# Altium schematic sheet LEDs, and Motors.SchDoc
size A4; SheetNumber: 2; SheetTotal: 3
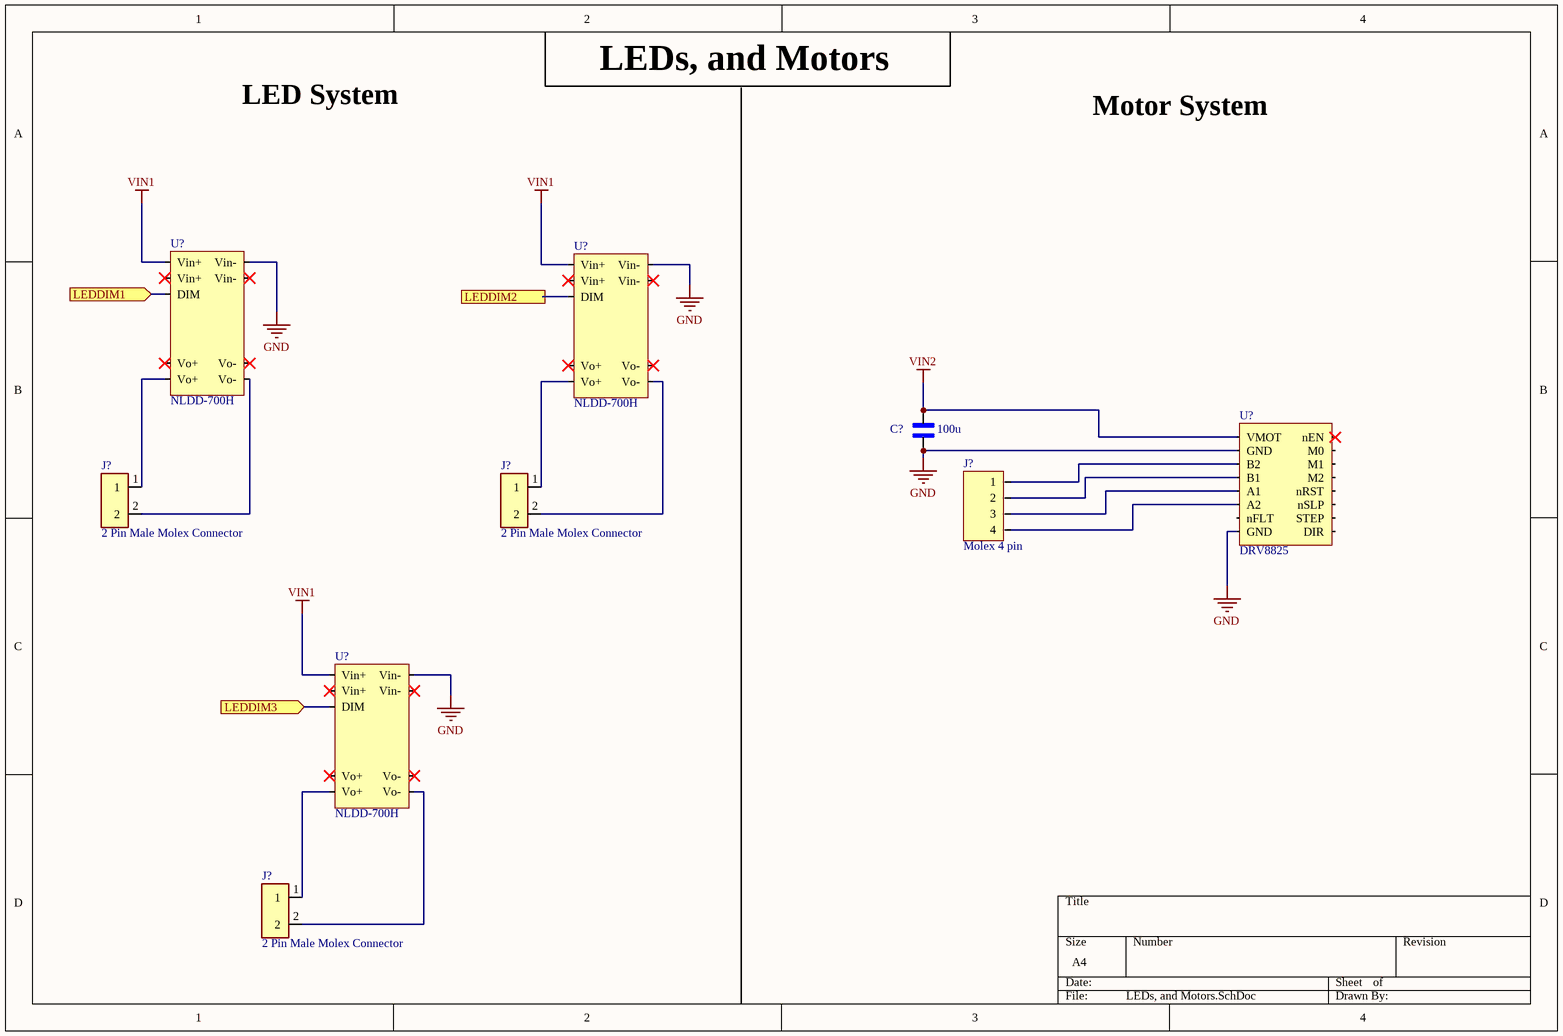
[diagram p0: LEDs, and Motors.SchDoc]

## Parts
(Parts that share a designator on the sheet are numbered #1, #2 ... from top to bottom, then left to right.)
C?  100u  [CAP 0805]
J?#1  Molex 4 pin  [Connector Molex MicroFit+ 4 Pos R/A]
J?#2  2 Pin Male Molex Connector  [MOLEX_0436500200]
J?#3  2 Pin Male Molex Connector  [MOLEX_0436500200]
J?#4  2 Pin Male Molex Connector  [MOLEX_0436500200]
U?#1  NLDD-700H  [NLDD-700H]
U?#2  NLDD-700H  [NLDD-700H]
U?#3  DRV8825  [DRV8825]
U?#4  NLDD-700H  [NLDD-700H]

## Ports
LEDDIM1 (in), LEDDIM2 (in), LEDDIM3 (in)

## Nets
GND: C?.1 U?#1.9(Vin-) U?#2.9(Vin-) U?#3.2(GND) U?#3.8(GND) U?#4.9(Vin-)
VIN1: U?#1.1(Vin+) U?#2.1(Vin+) U?#4.1(Vin+)
VIN2: C?.2 U?#3.1(VMOT)
LEDDIM1: U?#1.3(DIM) ; port LEDDIM1
LEDDIM2: U?#2.3(DIM) ; port LEDDIM2
LEDDIM3: U?#4.3(DIM) ; port LEDDIM3
NetJ?#1_1: J?#1.1 U?#3.3(B2)
NetJ?#1_2: J?#1.2 U?#3.4(B1)
NetJ?#1_3: J?#1.3 U?#3.5(A1)
NetJ?#1_4: J?#1.4 U?#3.6(A2)
NetJ?#2_1: J?#2.1 U?#1.5(Vo+)
NetJ?#2_2: J?#2.2 U?#1.6(Vo-)
NetJ?#3_1: J?#3.1 U?#2.5(Vo+)
NetJ?#3_2: J?#3.2 U?#2.6(Vo-)
NetJ?#4_1: J?#4.1 U?#4.5(Vo+)
NetJ?#4_2: J?#4.2 U?#4.6(Vo-)

Not connected (* = marked no-connect by the designer): U?#1 2(Vin+)* 4(Vo+)* 7(Vo-)* 8(Vin-)*; U?#2 2(Vin+)* 4(Vo+)* 7(Vo-)* 8(Vin-)*; U?#3 7(nFLT) 9(DIR) 10(STEP) 11(nSLP) 12(nRST) 13(M2) 14(M1) 15(M0) 16(nEN)*; U?#4 2(Vin+)* 4(Vo+)* 7(Vo-)* 8(Vin-)*

## Notes on the sheet
- LED System
- LEDs, and Motors
- Motor System

## Library data of the parts
C? = CAP 0805: SnapEDA_Link: https://www.snapeda.com/parts/C2012X8R1H104K125AA/TDK/view-part/?ref=snap; Check_prices: https://www.snapeda.com/parts/C2012X8R1H104K125AA/TDK/view-part/?ref=eda; Value: *
J?#2-J?#4 = 0436500200: Micro-fit 3.0 Connector, 2 Circuit Single Row, Right Angle Throughhole PCB, Snap-In Peg; MF: Molex; SnapEDA_Link: https://www.snapeda.com/parts/0436500200/Molex/view-part/552556/?ref=snap; Price: None; Availability: Unavailable; Package: None; MP: 0436500200; Value: *
U?#1 U?#2 U?#4 = NLDD-700H: LED DC/DC Converter 10-56Vdc Input, 700mA Output, Board mount; Manufacturer: Mean Well; Supplier: Digikey; Supplier Part Number: 1866-NLDD-700H-ND; Manufacturer Part Number: NLDD-700H; RoHS: No; Stock: 280; Pricing: 1=5.45 (USD); ComponentLink1URL: https://datasheet.octopart.com/NLDD-700H-Mean-Well-datasheet-158237201.pdf?src-supplier=Component+Distributors+Inc.; ComponentLink1Description: https://datasheet.octopart.com/NLDD-700H-Mean-Well-datasheet-158237201.pdf?src-supplier=Component+Distributors+Inc.
U?#3 = DRV8825: DRV8825 Stepper Motor Driver Carrier, High Current